# Altium schematic sheet IO_Carte_Nucleo2_.SchDoc: I/O Carte Nucleo
size A4; Author: Xavier Hueber; Engineer: Xavier Hueber; Organization: Altium Limited; Address1: Laboratoire de Systèmes Embarqués; Address2: 7, rue de la Serre; Address3: 2610 Saint-Imier / Switzerland; Revision: 1; SheetNumber: 4; SheetTotal: 4
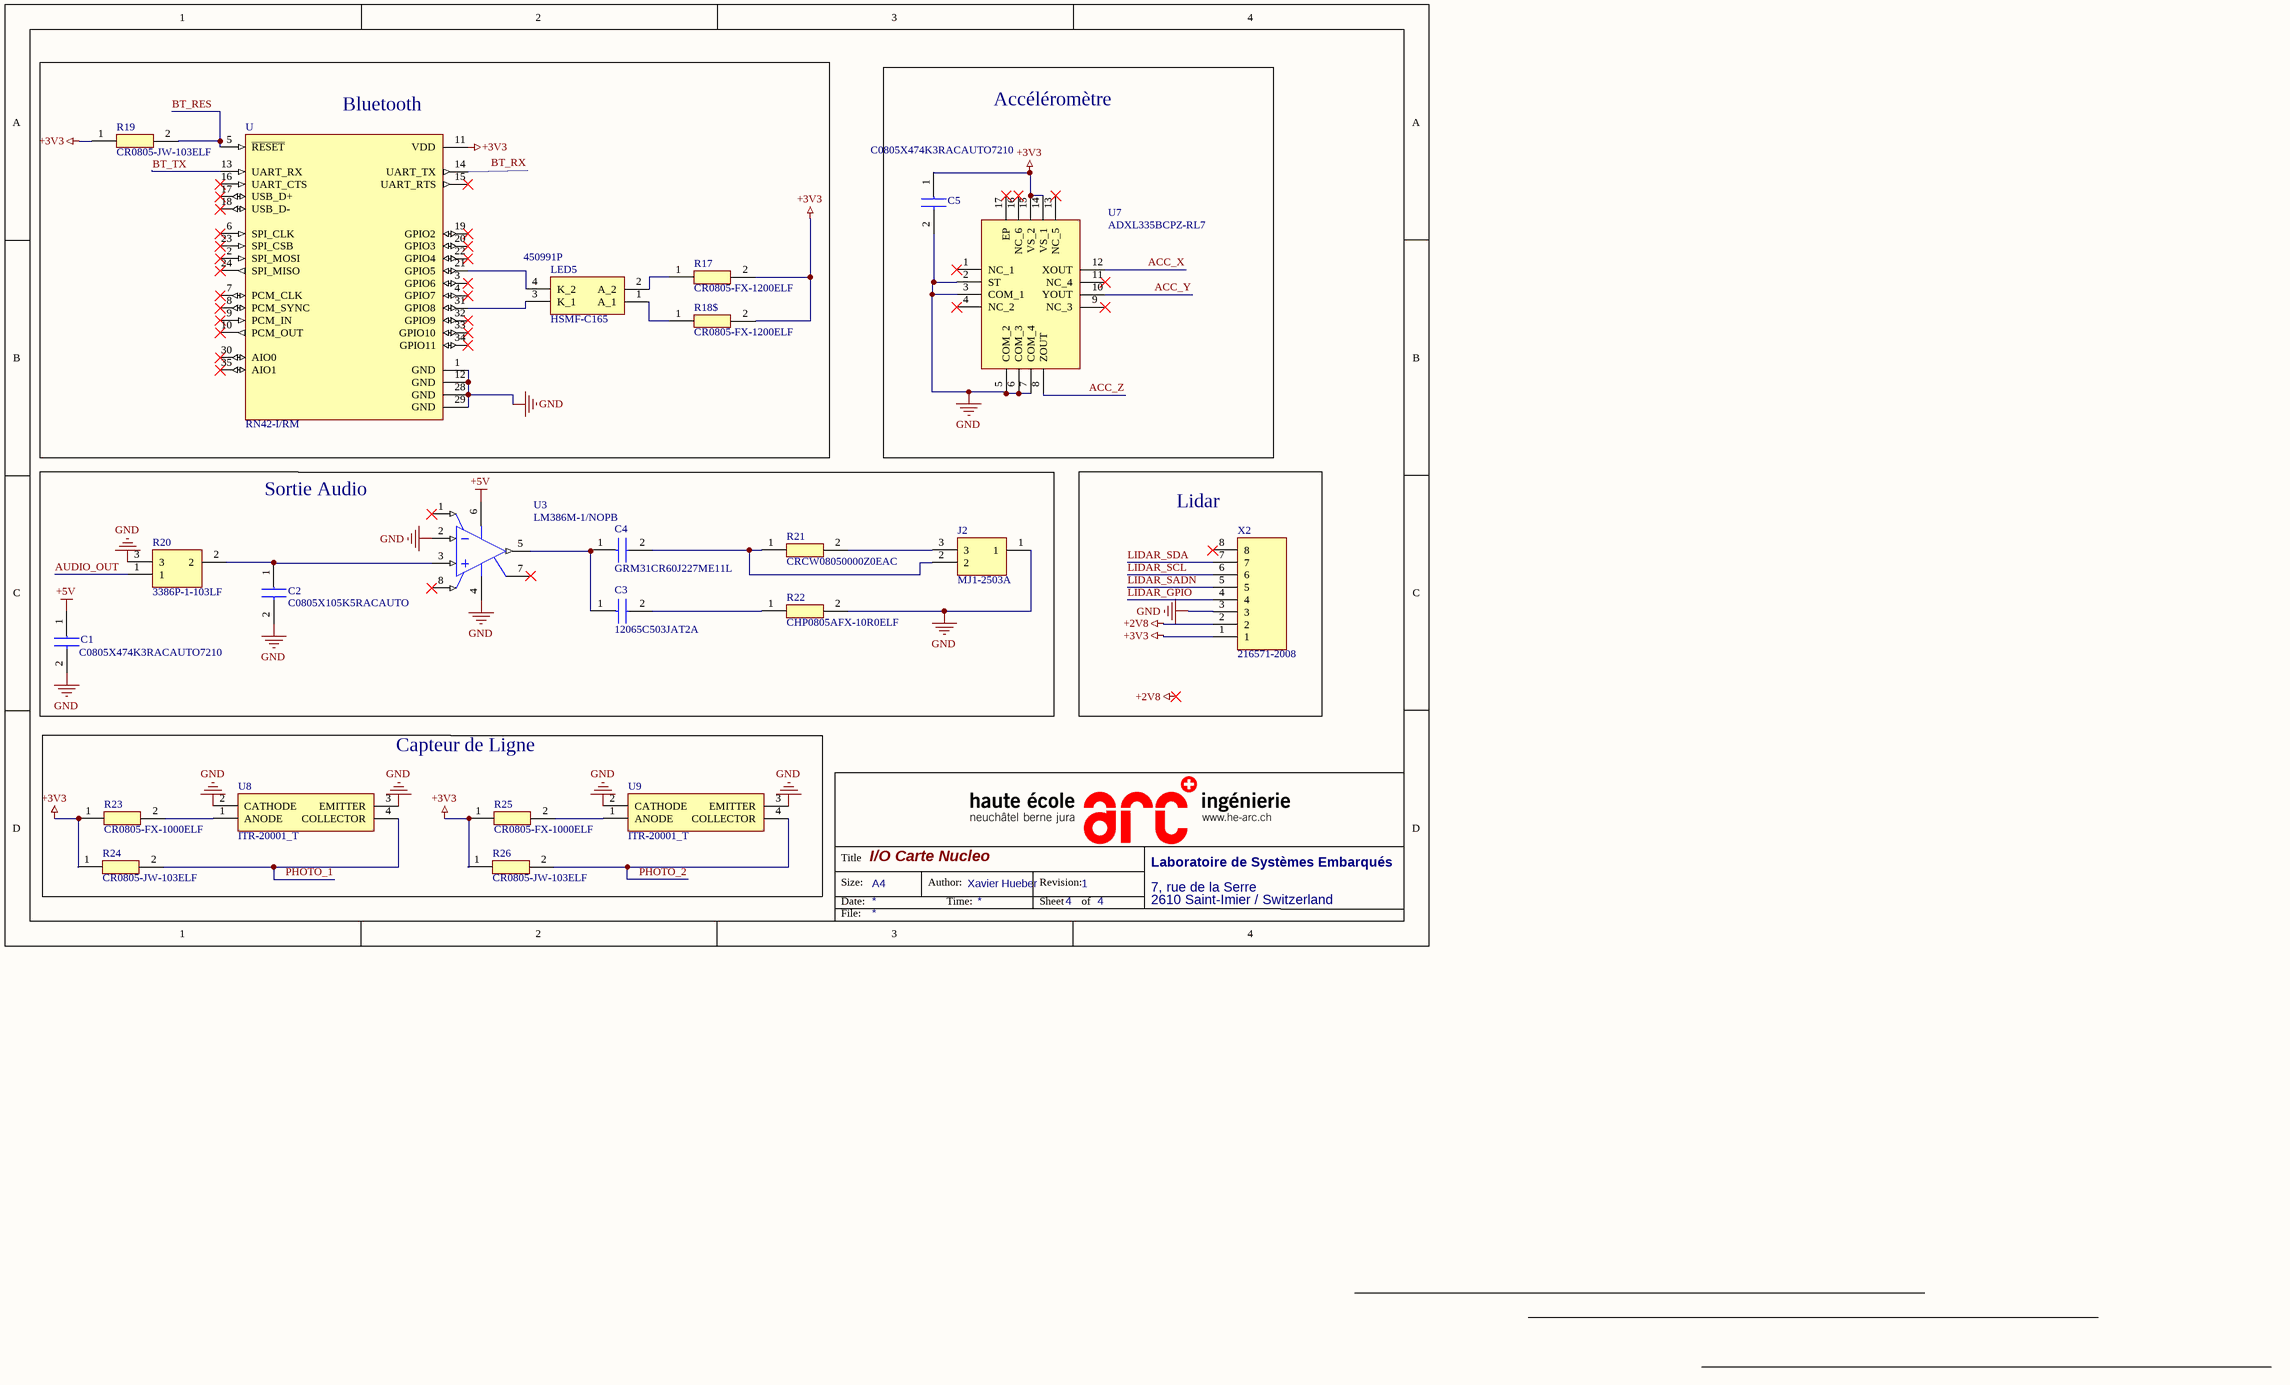
[diagram p0: IO_Carte_Nucleo2_.SchDoc]

## Parts
C1  C0805X474K3RACAUTO7210  [C0805]
C2  C0805X105K5RACAUTO  [CAPC2012X145N]
C3  12065C503JAT2A  [CAPC3216X94N]
C4  GRM31CR60J227ME11L  [CAPC3216X190N]
C5  C0805X474K3RACAUTO7210  [C0805]
J2  MJ1-2503A  [MJ12503A]
LED5  HSMF-C165  Supplier Part Number 1: 450991P  [HSMF-C163]
R17  CR0805-FX-1200ELF  [RESC2012X60N]
R18$  CR0805-FX-1200ELF  [RESC2012X60N]
R19  CR0805-JW-103ELF  [RESC2012X60N]
R20  3386P-1-103LF  [3386P_1]
R21  CRCW08050000Z0EAC  [RESC2012X60N]
R22  CHP0805AFX-10R0ELF  [RESC2012X60N]
R23  CR0805-FX-1000ELF  [RESC2012X60N]
R24  CR0805-JW-103ELF  [RESC2012X60N]
R25  CR0805-FX-1000ELF  [RESC2012X60N]
R26  CR0805-JW-103ELF  [RESC2012X60N]
U  RN42-I/RM  [XCVR_RN42-I/RM]
U3  LM386M-1/NOPB  [TI-D8_M]
U7  ADXL335BCPZ-RL7  [QFN65P400X400X150-17N-D]
U8  ITR-20001_T  [ITR20001T]
U9  ITR-20001_T  [ITR20001T]
X2  216571-2008  [216571-YY08]

## Blocks framed on the sheet
Bluetooth: LED5 R17 R18$ R19 U
Accéléromètre: C5 U7
Sortie Audio: C1-C4 J2 R20-R22 U3
Lidar: X2
Capteur de Ligne: R23-R26 U8 U9

## Nets
+2V8: X2.2
+3V3: C5.1 R17.2 R18$.2 R19.1 R23.1 R24.1 R25.1 R26.1 U.11(VDD) U7.14(VS_1) U7.15(VS_2) X2.1
+5V: C1.1 U3.6(VS)
GND: C1.2 C2.2 C5.2 J2.1 R20.3 R22.2 U.1(GND) U.12(GND) U.28(GND) U.29(GND) U3.2(IN-) U3.4(GND) U7.2(ST) U7.3(COM_1) U7.5(COM_2) U7.6(COM_3) U7.7(COM_4) U8.2(CATHODE) U8.3(EMITTER) U9.2(CATHODE) U9.3(EMITTER) X2.3
ACC_X: U7.12(XOUT)
ACC_Y: U7.10(YOUT)
ACC_Z: U7.8(ZOUT)
AUDIO_OUT: R20.1
BT_RES: R19.2 U.5(~{RESET})
BT_RX: U.14(UART_TX)
BT_TX: U.13(UART_RX)
LIDAR_GPIO: X2.4
LIDAR_SADN: X2.5
LIDAR_SCL: X2.6
LIDAR_SDA: X2.7
PHOTO_1: R24.2 U8.4(COLLECTOR)
PHOTO_2: R26.2 U9.4(COLLECTOR)
NetC2_1: C2.1 R20.2 U3.3(IN+)
NetC3_1: C3.1(C1) C4.1 U3.5(VOUT)
NetC3_2: C3.2(C2) R22.1
NetC4_2: C4.2 J2.2 R21.1
NetJ2_3: J2.3 R21.2
NetLED5_1: LED5.1(A_1) R18$.1
NetLED5_2: LED5.2(A_2) R17.1
NetLED5_3: LED5.3(K_1) U.31(GPIO8)
NetLED5_4: LED5.4(K_2) U.21(GPIO5)
NetR23_2: R23.2 U8.1(ANODE)
NetR25_2: R25.2 U9.1(ANODE)

Not connected (* = marked no-connect by the designer): U 2(SPI_MOSI)* 3(GPIO6)* 4(GPIO7)* 6(SPI_CLK)* 7(PCM_CLK)* 8(PCM_SYNC)* 9(PCM_IN)* 10(PCM_OUT)* 15(UART_RTS)* 16(UART_CTS)* 17(USB_D+)* 18(USB_D-)* 19(GPIO2)* 20(GPIO3)* 22(GPIO4)* 23(SPI_CSB)* 24(SPI_MISO)* 30(AIO0)* 32(GPIO9)* 33(GPIO10)* 34(GPIO11)* 35(AIO1)*; U3 1(GAIN)* 7(BYPASS)* 8(GAIN)*; U7 1(NC_1)* 4(NC_2)* 9(NC_3)* 11(NC_4)* 13(NC_5)* 16(NC_6)* 17(EP)*; X2 8*

## Notes on the sheet
- Title
- Size:
- Date:
- A4
- Author:
- Time:
- Revision:
- Sheet
- of
- File:
- Labels drawn without touching a wire or pin: +2V8

## Library data of the parts
C1 C5 = C0805X474K3RACAUTO7210: Capacitor; Manufacturer_Name: KEMET; Datasheet Link: https://content.kemet.com/datasheets/KEM_C1078_X7R_FT-CAP_AUTO_SMD.pdf; Height: 1.1mm; Manufacturer_Part_Number: C0805X474K3RACAUTO7210
C2 = C0805X105K5RACAUTO: Capacitor; Manufacturer_Name: KEMET; Datasheet Link: https://connect.kemet.com:7667/gateway/IntelliData-ComponentDocumentation/1.0/download/specsheet/C0805X105K5RACAUTO; Height: 1.45mm; Manufacturer_Part_Number: C0805X105K5RACAUTO
C3 = 12065C503JAT2A: Capacitor; Manufacturer_Name: AVX; Manufacturer_Part_Number: 12065C503JAT2A
C4 = GRM31CR60J227ME11L: Capacitor; Manufacturer_Name: Murata Electronics; Datasheet Link: https://www.murata.com/products/productdetail?partno=GRM31CR60J227ME11%23; Height: 1.9mm; Manufacturer_Part_Number: GRM31CR60J227ME11L
J2 = MJ1-2503A: Connector; Manufacturer_Name: CUI Inc.; Datasheet Link: https://componentsearchengine.com//MJ1-2503A.pdf; Height: 5mm; Mouser2 Part Number: 490-MJ1-2503A; Mouser2 Price/Stock: https://www.mouser.com/Search/Refine.aspx?Keyword=490-MJ1-2503A; Manufacturer_Part_Number: MJ1-2503A
LED5 = HSMF-C165: LED Bi-Color Green/Red 570nm/636nm 4-Pin Chip 0603 T/R; Manufacturer_Name: Avago Technologies; Datasheet Link: https://componentsearchengine.com//HSMF-C165.pdf; Mouser2 Part Number: 630-HSMF-C165; Mouser2 Price/Stock: https://www.mouser.com/Search/Refine.aspx?Keyword=630-HSMF-C165; Manufacturer_Part_Number: HSMF-C165; Supplier 1: RSComponents
R17 R18$ = CR0805-FX-1200ELF: Resistor; Manufacturer_Name: Bourns; Datasheet Link: https://www.bourns.com/pdfs/chpreztr.pdf; Height: 0.6mm; Manufacturer_Part_Number: CR0805-FX-1200ELF
R19 = CR0805-JW-103ELF: BOURNS         CR0805-JW-103ELF            Surface Mount Chip Resistor, Thick Film, CR Series, 10 kohm, 125 mW,  5%, 150 V; Datasheet Link: https://componentsearchengine.com//CR0805-JW-103ELF.pdf; Height: 0.6mm; Supplier 1: Arrow Electronics; Supplier Part Number 1: CR0805-JW-103ELF
R20 = 3386P-1-103LF: Resistor; Manufacturer_Name: Bourns; Datasheet Link: https://componentsearchengine.com//3386P-1-103LF.pdf; Mouser2 Part Number: 652-3386P-1-103LF; Mouser2 Price/Stock: https://www.mouser.com/Search/Refine.aspx?Keyword=652-3386P-1-103LF; Manufacturer_Part_Number: 3386P-1-103LF
R21 = CRCW08050000Z0EAC: Resistor; Manufacturer_Name: Vishay; Datasheet Link: https://componentsearchengine.com//CRCW08050000Z0EAC.pdf; Height: 0.6mm; Mouser2 Part Number: 71-CRCW08050000Z0EAC; Mouser2 Price/Stock: https://www.mouser.com/Search/Refine.aspx?Keyword=71-CRCW08050000Z0EAC; Manufacturer_Part_Number: CRCW08050000Z0EAC
R22 = CHP0805AFX-10R0ELF: Resistor; Manufacturer_Name: Bourns; Datasheet Link: https://www.mouser.co.uk/datasheet/2/54/chp-a-1858677.pdf; Height: 0.6mm; Manufacturer_Part_Number: CHP0805AFX-10R0ELF
R23 R25 = CR0805-FX-1000ELF: Resistor; Manufacturer_Name: Bourns; Datasheet Link: https://www.bourns.com/pdfs/chpreztr.pdf; Height: 0.6mm; Manufacturer_Part_Number: CR0805-FX-1000ELF
R24 R26 = CR0805-JW-103ELF: Resistor; Manufacturer_Name: Bourns; Datasheet Link: https://componentsearchengine.com//CR0805-JW-103ELF.pdf; Height: 0.6mm; Mouser2 Part Number: 652-CR0805-JW-103ELF; Mouser2 Price/Stock: https://www.mouser.com/Search/Refine.aspx?Keyword=652-CR0805-JW-103ELF; Manufacturer_Part_Number: CR0805-JW-103ELF
U = RN42-I/RM: Bluetooth Bluetooth v2.1 +EDR, Class 2 Transceiver Module 2.4GHz Integrated, Trace Surface Mount; MF: Microchip; Value: *; Price: None; MP: RN42-I/RM; Availability: Unavailable; SnapEDA_Link: https://www.snapeda.com/parts/RN42-I/RM/Microchip/view-part/625546/?ref=snap; Package: SMD-35 Roving Networks
U3 = CMP-0994-00001-1: Low Voltage Audio Power Amplifier, 0 to 70 degC, 8-pin SOIC (D8), Green (RoHS & no Sb/Br); Manufacturer: Texas Instruments; Input Type: Analog; SubFamily: Mid/High-Power Amplifier; Max. Number of Speaker Outputs: 1; PackageVersion: 4040047-3/M, 06/2011; ComponentLink2Description: Datasheet; DatasheetVersion: SNAS545A; ComponentLink3URL: http://www.ti.com/litv/pdf/msoi002j; ComponentLink1URL: http://www.ti.com/; Mounting Technology: Surface Mount; Eco-Plan: Green (RoHS & no Sb/Br); ComponentLink3Description: Package Specification; ComponentLink2URL: http://www.ti.com/general/docs/lit/getliterature.tsp?genericPartNumber=LM386&fileType=pdf; PartNumber: LM386M-1/NOPB; PackageDescription: 8-Pin Plastic Small Outline, Body 4.9 x 3.9 mm, Pitch 1.27 mm; ComponentLink1Description: Manufacturer URL; Code_JEDEC: MS-012; PackageReference: D8
U7 = ADXL335BCPZ-RL7: Integrated Circuit; Manufacturer_Name: Analog Devices; Datasheet Link: https://componentsearchengine.com//ADXL335BCPZ-RL7.pdf; Height: 1.5mm; Mouser2 Part Number: 584-ADXL335BCPZ-R7; Mouser2 Price/Stock: https://www.mouser.com/Search/Refine.aspx?Keyword=584-ADXL335BCPZ-R7; Manufacturer_Part_Number: ADXL335BCPZ-RL7
U8 U9 = ITR-20001_T: Undefined or Miscellaneous; Manufacturer_Name: Everlight; Manufacturer_Part_Number: ITR-20001/T; Height: 6.8mm
X2 = 216571-2008: Connector; Manufacturer_Name: Molex; Datasheet Link: https://www.molex.com/pdm_docs/sd/2165711002_sd.pdf; Height: 9.91mm; Manufacturer_Part_Number: 216571-2008